# EAGLE schematic power-dist-board (EAGLE 9.2.2)
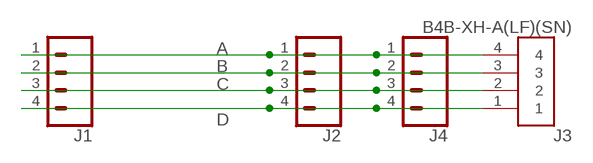
[diagram p0: schematic, sheet 1]

## Parts
J1  CONN_04  [1X04]
J2  CONN_04  [1X04]
J3  B4B-XH-A(LF)(SN)  [JST_B4B-XH-A(LF)(SN)]
J4  CONN_04  [1X04]

## Nets
A: J1.1 J2.1 J3.4 J4.1
B: J1.2 J2.2 J3.3 J4.2
C: J1.3 J2.3 J3.2 J4.3
D: J1.4 J2.4 J3.1 J4.4

## Library data of the parts
J1 J2 J4 = RoverWing-cover-V1.6:CONN_04: Multi connection point. Often used as Generic Header-pin footprint for 0.1 inch spaced/style header connections On any of the 0.1 inch spaced packages, you can populate with these: Break Away Headers - Straight <https://www.sparkfun.com/products/116> (PRT-00116) Break Away Male Headers - Right Angle <https://www.sparkfun.com/products/553> (PRT-00553) Female Headers <https://www.sparkfun.com/products/115> (PRT-00115) Break Away Headers - Machine Pin <https://www.sparkfun.com/products/117> (PRT-00117) Break Away Female Headers - Swiss Machine Pin <https://www.sparkfun.com/products/743> (PRT-00743) For SCREWTERMINALS and SPRING TERMINALS visit here: Screw Terimnals on SparkFun.com <https://www.sparkfun.com/search/results?term=Screw+Terminals> (5mm/3.5mm/2.54mm spacing) This device is also useful as a general connection point to wire up your design to another part of your project. Our various solder wires solder well into these plated through hole pads. Hook-Up Wire - Assortment (Stranded, 22 AWG) <https://www.sparkfun.com/products/11375> (PRT-11375) Hook-Up Wire - Assortment (Solid Core, 22 AWG) <https://www.sparkfun.com/products/11367> (PRT-11367) View the entire wire category on our website here <https://www.sparkfun.com/categories/141> Special notes: Molex polarized connector foot print use with SKU : PRT-08231 with associated crimp pins and housings. 1MM SMD Version SKU: PRT-10208; PROD_ID: CONN-09696
J3 = RoverWing-V1.5:B4B-XH-A(LF)(SN): XH Series 4 Position 2.5 mm Pitch Through Hole Crimp Top Entry Shrouded Header; DESCRIPTION: Connector Header Through Hole 4 position 0.098 (2.50mm); DIGI-KEY_PART_NUMBER: 455-2249-ND; DIGIKEY-PURCHASE-URL: https://snapeda.com/shop?store=DigiKey&id=447494; MF: JST Sales; MP: B4B-XH-A(LF)(SN); PACKAGE: None